# EAGLE design ep_board (EAGLE 9.6.2)
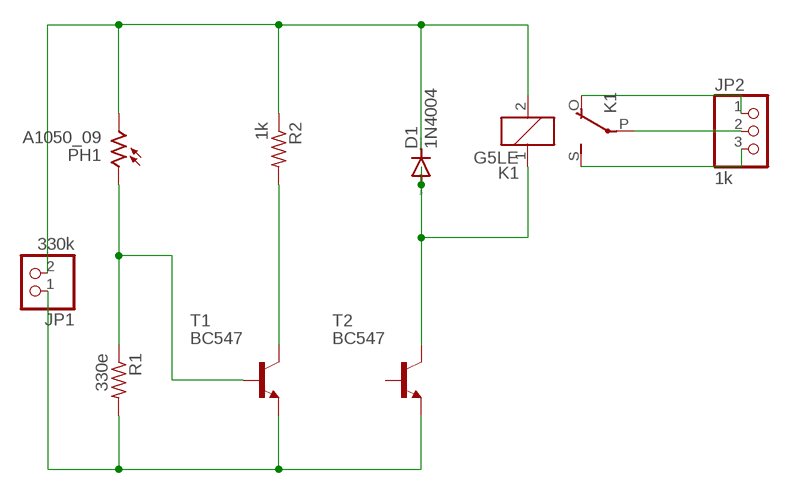
[diagram p0: schematic, sheet 1]

## Parts
D1  1N4004  [DO41-10]
JP1  330k  PINHD-1X2  [1X02]
JP2  1k  PINHD-1X3  [1X03]
K1  G5LE  [G5LE]
PH1  A1050_09  [T0-46-A10XX]
R1  330e  R-US_0207/10  [0207/10]
R2  1k  R-US_0207/10  [0207/10]
T1  BC547  [TO92]
T2  BC547  [TO92]

## Nets
N$1: JP2.2 K1.P(2:P)
N$2: D1.C JP1.2 K1.2 PH1.2 R2.1
N$3: PH1.1 R1.1 T1.2(B)
N$4: JP1.1 R1.2 T1.1(E) T2.1(E)
N$5: R2.2 T1.3(C)
N$6: D1.A K1.1 T2.3(C)
N$8: JP2.3 K1.S(2:S)
N$9: JP2.1 K1.O(2:O)
Unconnected: T2.2(B)

## Library data of the parts
D1 = diode:1N4004: DIODE general purpose rectifier, 1 A
JP1 = pinhead:PINHD-1X2: PIN HEADER
JP2 = pinhead:PINHD-1X3: PIN HEADER
K1 = relay:G5LE: RELAY 1 x switch, 10 A/120 V AC, 8 A/30 V DC, Omron; OC_FARNELL: unknown; OC_NEWARK: unknown
PH1 = photo-elements:A10: Sensor Robust Light Sensing Applications Outdoor Light Sensing Application Source: http://optoelectronics.perkinelmer.com/content/Datasheets/DTS_PhotocellsA1050.pdf
R1 R2 = rcl:R-US_: RESISTOR, American symbol; SPICEPREFIX: R
T1 T2 = transistor:BC547: NPN TRANSISTOR

## Board
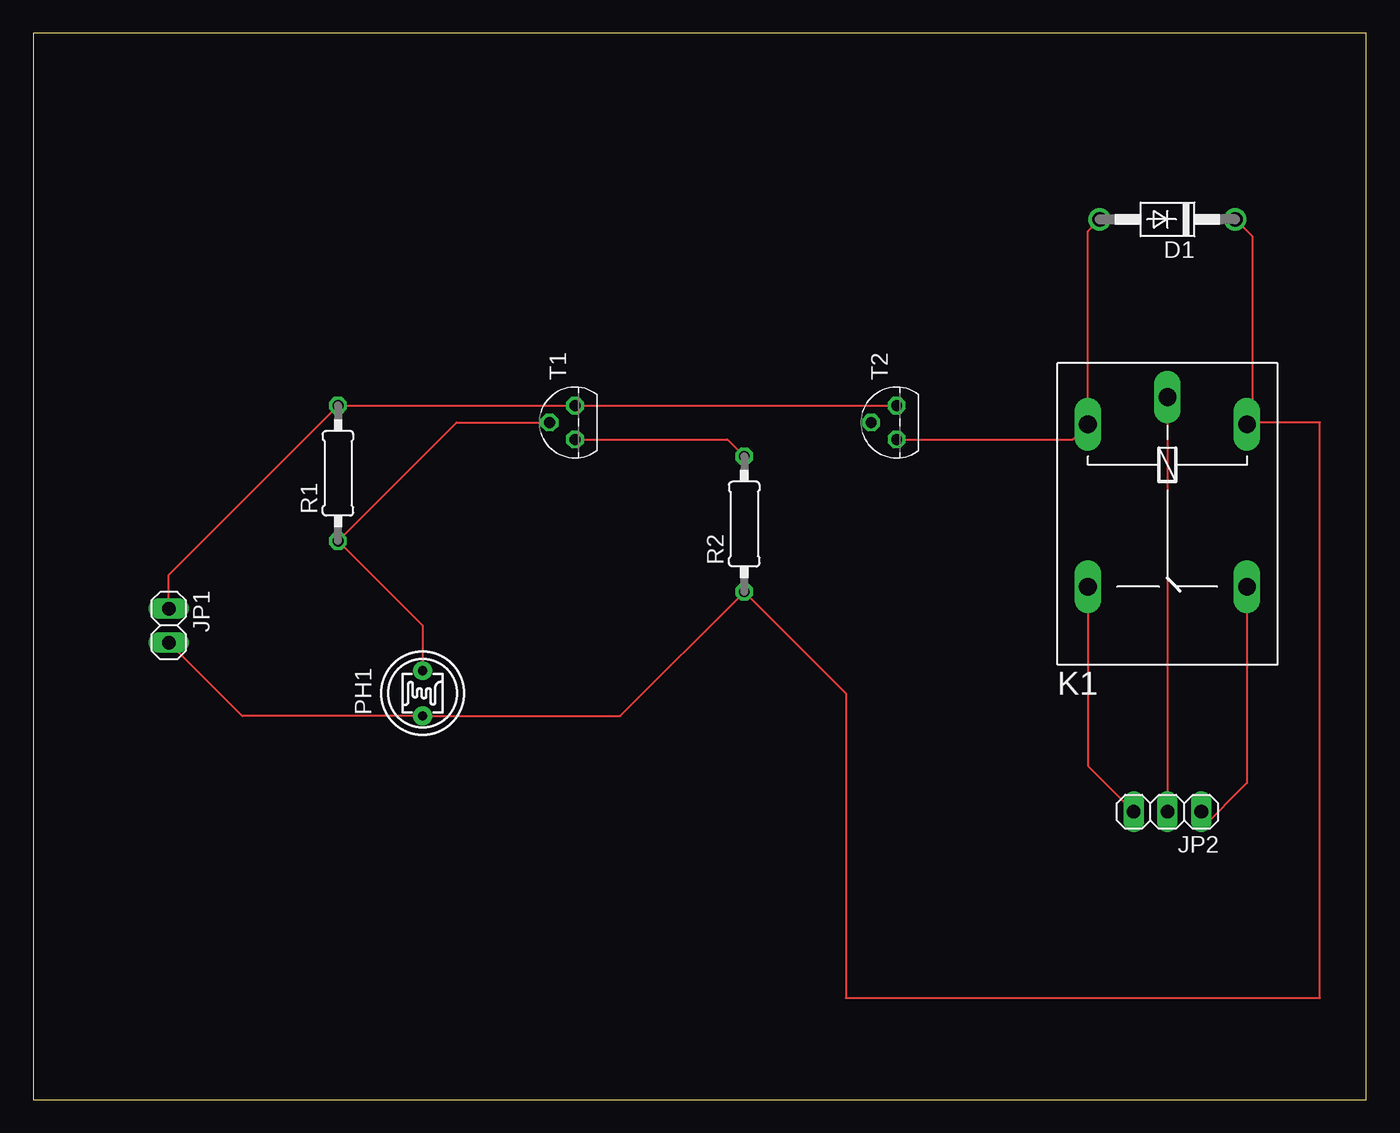
[diagram p1: board, top side]

Size 100 x 80 mm. Coordinates in mm from the lower left corner, seen from the top.
Outline: 0,0 100,0 100,80 0,80 0,0
Copper layers (1*16): Top 0.035mm / dielectric 1.5mm / Bottom 0.035mm
Design rules "default": minimum track width 6mil, minimum drill 0.35mm, track to track 6mil, track to pad 6mil, pad to pad 6mil, via to via 6mil, smd to smd 6mil, copper to edge 40mil, drill to drill 6mil, minimum pad ring 10mil, minimum via ring 8mil, stop-mask expansion 4mil, vias tented up to drill 0mil, thermal gap 10mil

### Footprints (pad centres in the part's own frame; a part is rotated, then mirrored left to right if it is on the bottom)
DO41-10 = drill 1.118: A 5.08,0; C -5.08,0
1X02 = drill 1.016 long: 1 -1.27,0; 2 1.27,0
1X03 = drill 1.016 long: 1 -2.54,0; 2 0,0; 3 2.54,0
G5LE = drill 1.321 long: 1 -7.493,-5.969; 2 -7.493,5.969; O 4.699,5.969; P -9.525,0; S 4.699,-5.969
T0-46-A10XX = drill 0.7 pad 1.4: 1 -1.7,0; 2 1.7,0
0207/10 = drill 0.813 octagon: 1 -5.08,0; 2 5.08,0
TO92 = drill 0.813 octagon: 1 1.27,0; 2 0,1.905; 3 -1.27,0

### Placement (x,y rotation side)
D1  85.09,66.04 180 top
JP1  10.16,35.56 270 top
JP2  85.09,21.59 180 top
K1  85.09,43.18 270 top
PH1  29.21,30.48 270 top
R1  22.86,46.99 90 top
R2  53.34,43.18 90 top
T1  40.64,50.8 90 top
T2  64.77,50.8 90 top

### Tracks (layer width: path | path; a pad name or v marks a point on that pad's centre or on a via)
N$1
  Top 0.152: K1.P JP2.2
N$2
  Top 0.152: JP1.2 15.67,28.78 PH1.2 44.02,28.78 R2.1 60.96,30.48 60.96,7.62 96.52,7.62 96.52,50.8 91.44,50.8 | 91.44,50.8 91.19,50.8 K1.2 | D1.C 91.44,64.77 91.44,50.8
N$3
  Top 0.152: PH1.1 29.21,35.56 R1.1 31.75,50.8 T1.2
N$4
  Top 0.152: T2.1 T1.1 R1.2 10.16,39.37 JP1.1
N$5
  Top 0.152: T1.3 52.07,49.53 R2.2
N$6
  Top 0.152: T2.3 77.98,49.53 K1.1 79.12,65.15 D1.A
N$8
  Top 0.152: K1.S 79.12,25.02 JP2.3
N$9
  Top 0.152: JP2.1 87.63,20.32 91.06,23.75 K1.O